# Altium schematic sheet drvinput6.SchDoc
size A4
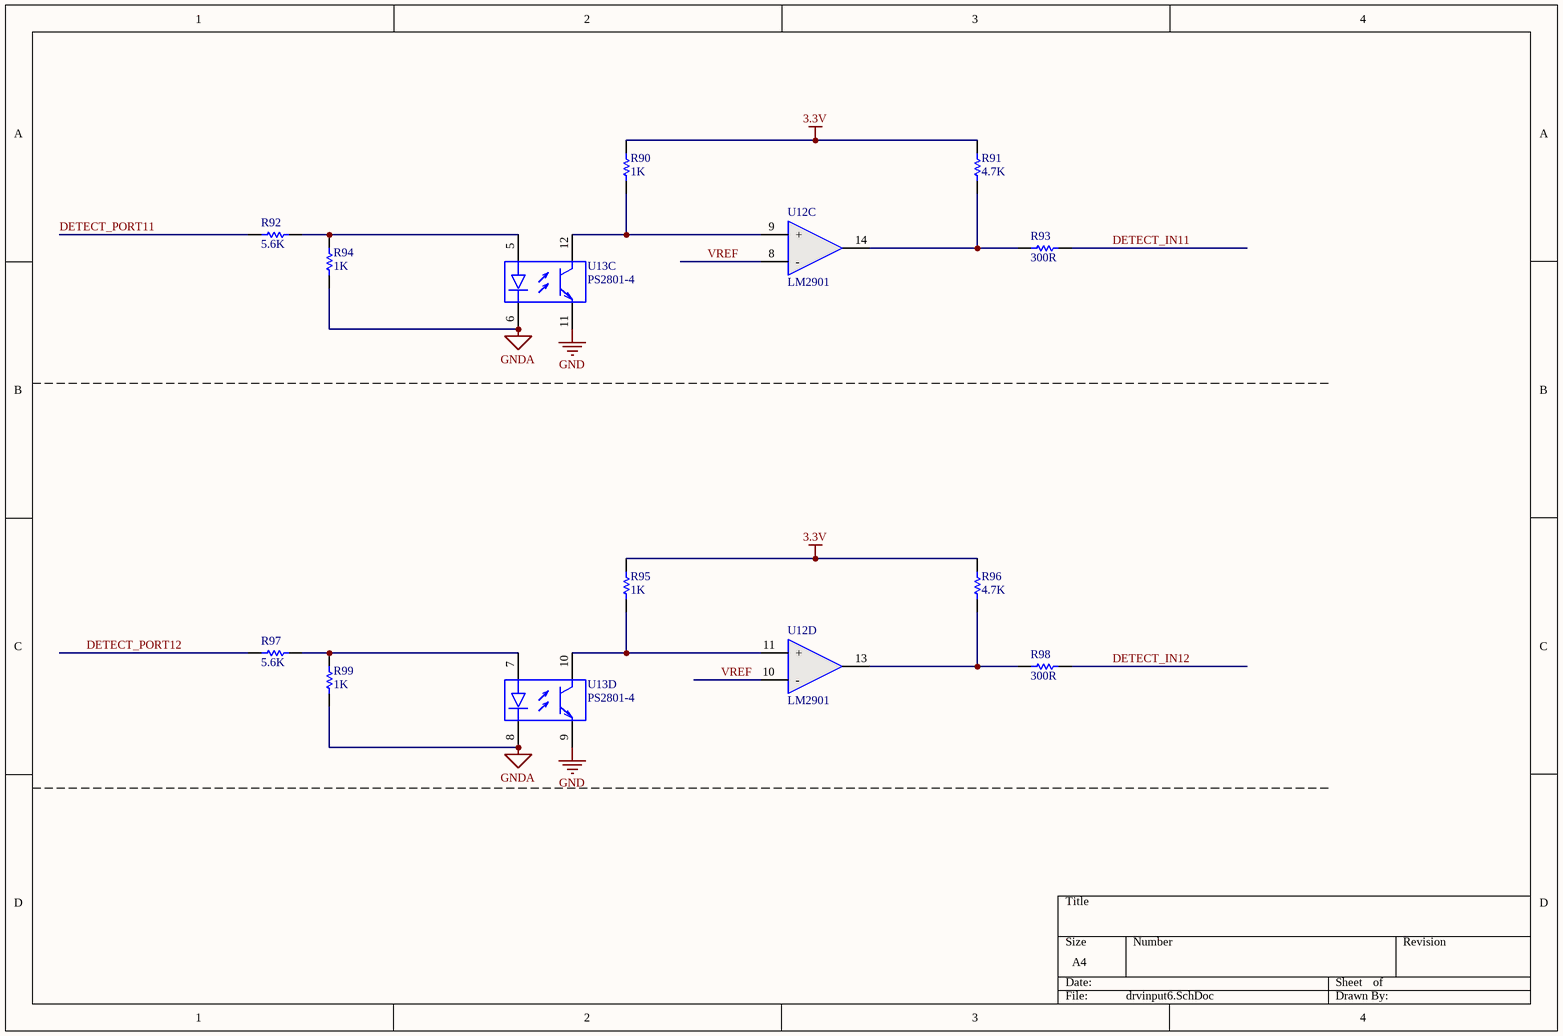
[diagram p0: drvinput6.SchDoc]

## Parts
R90  1K  [RESC2012M]
R91  4.7K  [RESC2012M]
R92  5.6K  [RESC2012M]
R93  300R  [RESC2012M]
R94  1K  [RESC2012M]
R95  1K  [RESC2012M]
R96  4.7K  [RESC2012M]
R97  5.6K  [RESC2012M]
R98  300R  [RESC2012M]
R99  1K  [RESC2012M]
U12  LM2901  [SOIC-14AM]  (parts C,D of 4)
U13  PS2801-4  [SOIC16_N]  (parts C,D of 4)

## Nets
3.3V: R90.1 R91.2 R95.1 R96.2
GND: U13.9(E) U13.11(E)
GNDA: R94.1 R99.1 U13.6(-) U13.8(-)
DETECT_IN11: R93.1
DETECT_IN12: R98.2
DETECT_PORT11: R92.2
DETECT_PORT12: R97.2
VREF: U12.8(-) U12.10(-)
NetR90_2: R90.2 U12.9(+) U13.12(C)
NetR91_1: R91.1 R93.2 U12.14(OUT)
NetR92_1: R92.1 R94.2 U13.5(+)
NetR95_2: R95.2 U12.11(+) U13.10(C)
NetR96_1: R96.1 R98.1 U12.13(OUT)
NetR97_1: R97.1 R99.2 U13.7(+)

## Library data of the parts
R90-R97 R99 = Res1: Resistor; Value: 10K; Published: 8-Jun-2000; LatestRevisionDate: 17-Jul-2002; LatestRevisionNote: Re-released for DXP Platform.; PackageReference: AXIAL-0.3; Publisher: Altium Limited
R98 = Res1: Resistor; Value: 470; Published: 8-Jun-2000; LatestRevisionDate: 17-Jul-2002; LatestRevisionNote: Re-released for DXP Platform.; PackageReference: AXIAL-0.3; Publisher: Altium Limited
U12 = LM2901: 4通道差分比较器芯片
U13 = PS2801-4: The PS2801-1 and PS2801-4 are optically coupled isolators containing a GaAs light emitting diode and an NPN  silicon phototransistor in a plastic SOP for high density applications.; Published: 28-Feb-2003; LatestRevisionDate: 13-Apr-2006; LatestRevisionNote: IPC-7351 Footprint Added.; DatasheetVersion: Jan-2002, Rev. 7; PackageVersion: rev7, Jan-2002; PackageReference: 751-07; Publisher: Altium Limited; PackageDescription: 8-Pin Plastic Small Outline Integrated Circuit 1.27 mm Pitch; Code_JEDEC: MS-012-AA; Code_IPC: SOIC127P600-8; ComponentLink1Description: Manufacturer Link; ComponentLink1URL: http://www.onsemi.com/; ComponentLink2Description: Datasheet; ComponentLink2URL: http://www.onsemi.com/pub/Collateral/LM358-D.PDF